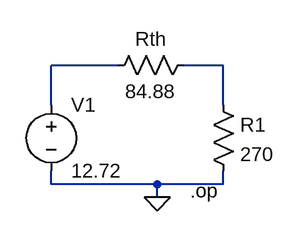
[diagram p0: schematic Thevenin_3_3.asc]
Thevenin_3_3.asc, the LTspice schematic file:
Version 4
SHEET 1 880 680
WIRE 96 96 16 96
WIRE 224 96 176 96
WIRE 16 144 16 96
WIRE 224 144 224 96
WIRE 16 240 16 224
WIRE 144 240 16 240
WIRE 224 240 224 224
WIRE 224 240 144 240
WIRE 144 256 144 240
FLAG 144 256 0
SYMBOL voltage 16 128 R0
WINDOW 123 0 0 Left 0
WINDOW 39 0 0 Left 0
SYMATTR InstName V1
SYMATTR Value 12.72
SYMBOL res 192 80 R90
WINDOW 0 0 56 VBottom 2
WINDOW 3 32 56 VTop 2
SYMATTR InstName Rth
SYMATTR Value 84.88
SYMBOL res 208 128 R0
SYMATTR InstName R1
SYMATTR Value 270
TEXT 184 248 Left 2 !.op

The netlist it stands for:
* Thevenin_3_3.asc
V1 N001 0 12.72
Rth N002 N001 84.88
R1 N002 0 270
.op
.backanno
.end